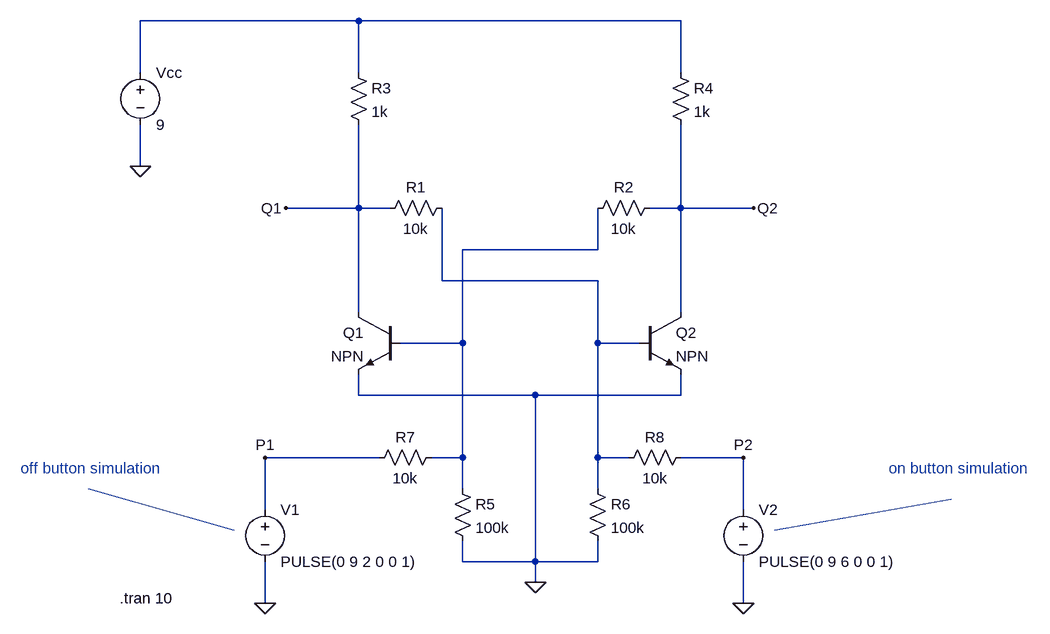
[diagram p0: schematic 2.latch.asc]
2.latch.asc, the LTspice schematic file:
Version 4.1
SHEET 1 1044 680
WIRE -64 -320 -400 -320
WIRE 432 -320 -64 -320
WIRE -400 -240 -400 -320
WIRE -64 -240 -64 -320
WIRE 432 -240 432 -320
WIRE -400 -96 -400 -160
WIRE -64 -32 -64 -160
WIRE -64 -32 -176 -32
WIRE -16 -32 -64 -32
WIRE 432 -32 432 -160
WIRE 432 -32 384 -32
WIRE 544 -32 432 -32
WIRE 304 32 304 -32
WIRE 304 32 96 32
WIRE 64 80 64 -32
WIRE 304 80 64 80
WIRE -64 128 -64 -32
WIRE 432 128 432 -32
WIRE 96 176 96 32
WIRE 96 176 0 176
WIRE 304 176 304 80
WIRE 368 176 304 176
WIRE -64 256 -64 224
WIRE 208 256 -64 256
WIRE 432 256 432 224
WIRE 432 256 208 256
WIRE -32 352 -208 352
WIRE 96 352 96 176
WIRE 96 352 48 352
WIRE 304 352 304 176
WIRE 352 352 304 352
WIRE 528 352 432 352
WIRE 96 400 96 352
WIRE 304 400 304 352
WIRE -208 432 -208 352
WIRE 528 432 528 352
WIRE 96 512 96 480
WIRE 208 512 208 256
WIRE 208 512 96 512
WIRE 304 512 304 480
WIRE 304 512 208 512
WIRE 208 544 208 512
WIRE -208 576 -208 512
WIRE 528 576 528 512
FLAG 208 544 0
FLAG -400 -96 0
FLAG -176 -32 Q1
FLAG 544 -32 Q2
FLAG -208 576 0
FLAG 528 576 0
FLAG -208 352 P1
FLAG 528 352 P2
SYMBOL npn 0 128 M0
SYMATTR InstName Q1
SYMBOL npn 368 128 R0
SYMATTR InstName Q2
SYMBOL res 80 -48 R90
WINDOW 0 0 56 VBottom 2
WINDOW 3 32 56 VTop 2
SYMATTR InstName R1
SYMATTR Value 10k
SYMBOL res 400 -48 R90
WINDOW 0 0 56 VBottom 2
WINDOW 3 32 56 VTop 2
SYMATTR InstName R2
SYMATTR Value 10k
SYMBOL res -80 -256 R0
SYMATTR InstName R3
SYMATTR Value 1k
SYMBOL res 416 -256 R0
SYMATTR InstName R4
SYMATTR Value 1k
SYMBOL voltage -400 -256 R0
WINDOW 123 0 0 Left 0
WINDOW 39 0 0 Left 0
SYMATTR InstName Vcc
SYMATTR Value 9
SYMBOL res 80 384 R0
SYMATTR InstName R5
SYMATTR Value 100k
SYMBOL res 288 384 R0
SYMATTR InstName R6
SYMATTR Value 100k
SYMBOL res 64 336 R90
WINDOW 0 0 56 VBottom 2
WINDOW 3 32 56 VTop 2
SYMATTR InstName R7
SYMATTR Value 10k
SYMBOL res 448 336 R90
WINDOW 0 0 56 VBottom 2
WINDOW 3 32 56 VTop 2
SYMATTR InstName R8
SYMATTR Value 10k
SYMBOL voltage -208 416 R0
WINDOW 123 0 0 Left 0
WINDOW 39 0 0 Left 0
SYMATTR InstName V1
SYMATTR Value PULSE(0 9 2 0 0 1)
SYMBOL voltage 528 416 R0
WINDOW 123 0 0 Left 0
WINDOW 39 0 0 Left 0
SYMATTR InstName V2
SYMATTR Value PULSE(0 9 6 0 0 1)
TEXT -432 568 Left 2 !.tran 10
TEXT 752 368 Left 2 ;on button simulation
TEXT -584 368 Left 2 ;off button simulation
LINE Normal -256 464 -480 400
LINE Normal 576 464 848 416

The netlist it stands for:
* 2.latch.asc
Q1 Q1 N002 0 0 NPN
Q2 Q2 N003 0 0 NPN
R1 N003 Q1 10k
R2 Q2 N002 10k
R3 N001 Q1 1k
R4 N001 Q2 1k
Vcc N001 0 9
R5 N002 0 100k
R6 N003 0 100k
R7 N002 P1 10k
R8 P2 N003 10k
V1 P1 0 PULSE(0 9 2 0 0 1)
V2 P2 0 PULSE(0 9 6 0 0 1)
.model NPN NPN
.model PNP PNP
.lib standard.bjt
.tran 10
* on button simulation
* off button simulation
.backanno
.end